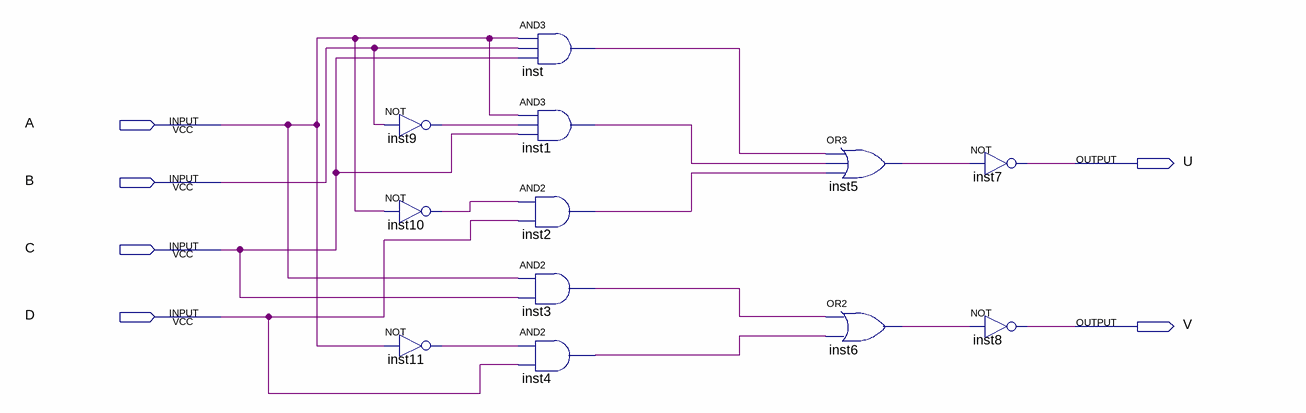
[diagram p0: schematic sheet]
// Quartus schematic LAB_2_129.bdf as structural Verilog: 12 symbols, 6 pins
module LAB_2_129 (
  input  A,
  input  B,
  input  C,
  input  D,
  output U,
  output V
);

  wire inst1_out, inst2_out, inst3_out, inst4_out, inst5_out, inst6_out, inst9_out, inst10_out, inst11_out,
       inst_out;

  not inst9 (inst9_out, B);
  not inst10 (inst10_out, A);
  not inst11 (inst11_out, A);
  and inst (inst_out, A, B, C);
  and inst1 (inst1_out, A, inst9_out, C);
  and inst2 (inst2_out, inst10_out, D);
  and inst3 (inst3_out, A, C);
  and inst4 (inst4_out, inst11_out, D);
  or inst5 (inst5_out, inst_out, inst1_out, inst2_out);
  or inst6 (inst6_out, inst3_out, inst4_out);
  not inst7 (U, inst5_out);
  not inst8 (V, inst6_out);
endmodule
